# EAGLE design proto_base (EAGLE 9.6.2)
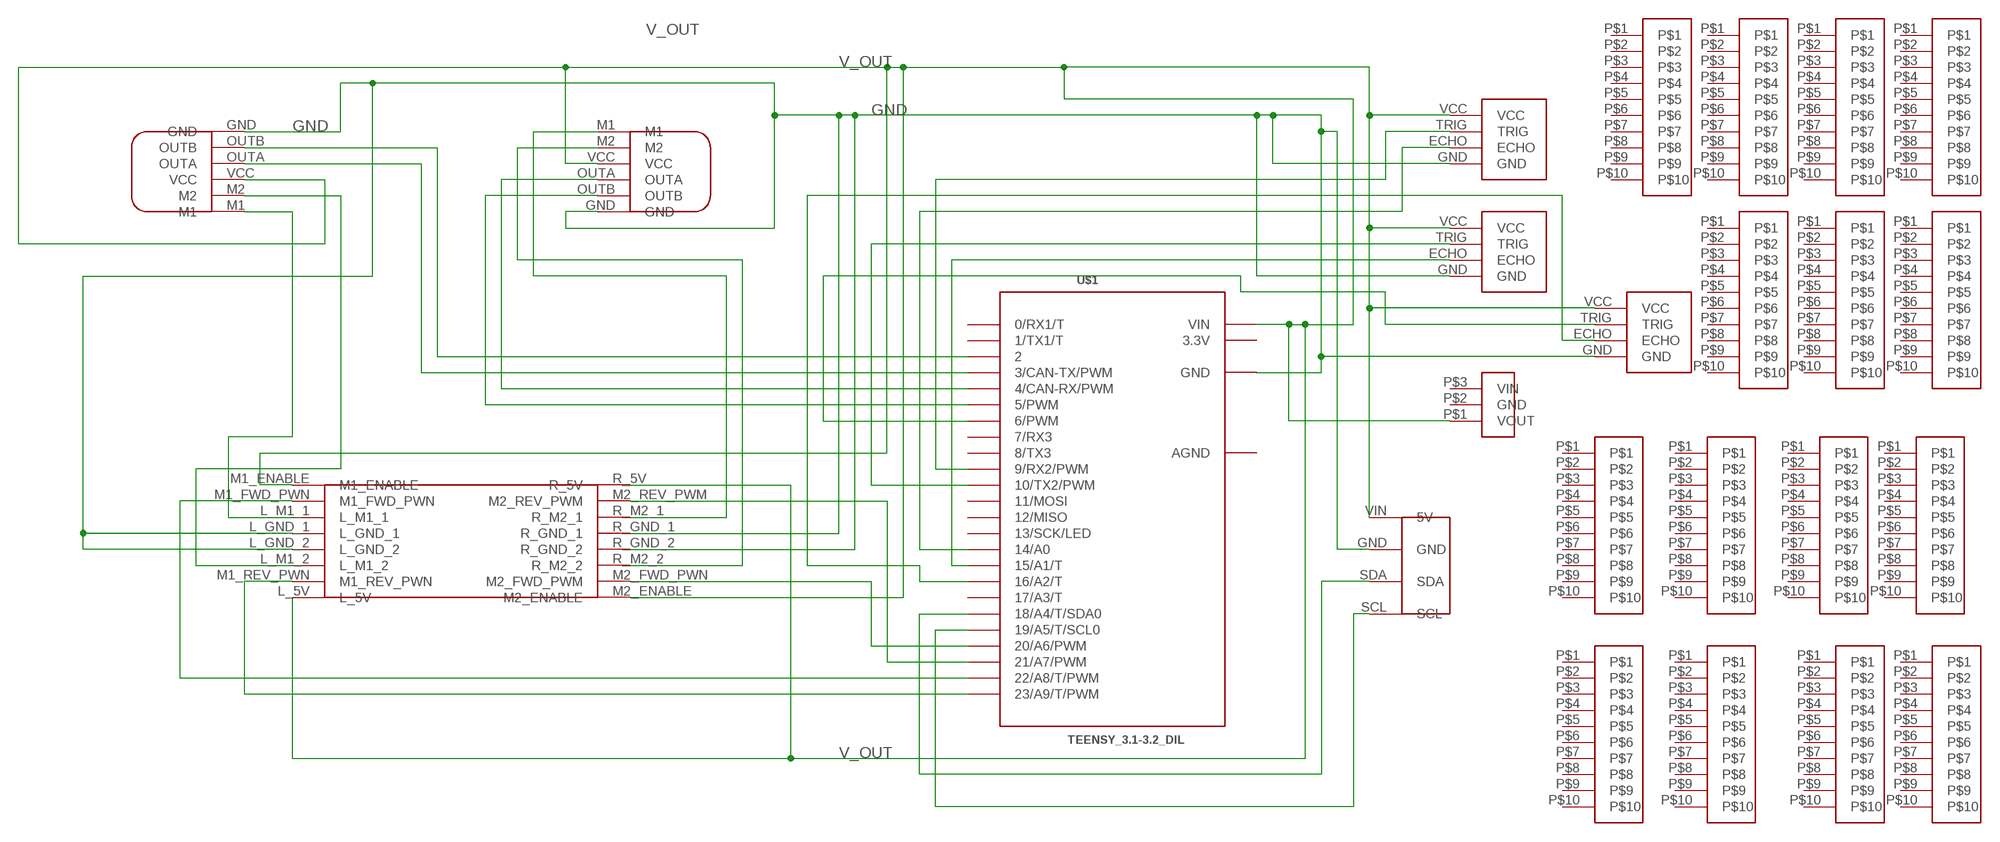
[diagram p0: schematic, sheet 1]

## Parts
IMU  IMU  [IMU]
LEFT_ENCODER  MOTOR_ENCODER  [MOTOR_ENCODER]
MOTOR_DRIVER  MOTOR_DRIVER  [MOTOR_DRIVER]
RIGHT_ENCODER  MOTOR_ENCODER  [MOTOR_ENCODER]
U$1  TEENSY_3.1-3.2_DIL  [TEENSY_3.0-3.2&LC_DIL]
U$2  VOLTAGE_REGULATOR  [VOLTAGE_REGULATOR]
U$3  SONAR_SENSOR  [SONAR_SENSOR]
U$4  SONAR_SENSOR  [SONAR_SENSOR]
U$5  SONAR_SENSOR  [SONAR_SENSOR]
U$6  TEST_ROW  [TEST_ROW]
U$7  TEST_ROW  [TEST_ROW]
U$8  TEST_ROW  [TEST_ROW]
U$9  TEST_ROW  [TEST_ROW]
U$10  TEST_ROW  [TEST_ROW]
U$11  TEST_ROW  [TEST_ROW]
U$12  TEST_ROW  [TEST_ROW]
U$13  TEST_ROW  [TEST_ROW]
U$14  TEST_ROW  [TEST_ROW]
U$15  TEST_ROW  [TEST_ROW]
U$16  TEST_ROW  [TEST_ROW]
U$17  TEST_ROW  [TEST_ROW]
U$18  TEST_ROW  [TEST_ROW]
U$19  TEST_ROW  [TEST_ROW]
U$20  TEST_ROW  [TEST_ROW]

## Nets
GND: IMU.GND LEFT_ENCODER.GND MOTOR_DRIVER.L_GND_1 MOTOR_DRIVER.L_GND_2 MOTOR_DRIVER.R_GND_1 MOTOR_DRIVER.R_GND_2 RIGHT_ENCODER.GND U$1.GND U$3.GND U$4.GND U$5.GND
N$1: LEFT_ENCODER.OUTB U$1.2
N$2: LEFT_ENCODER.OUTA U$1.3(3/CAN-TX/PWM)
N$3: RIGHT_ENCODER.OUTA U$1.4(4/CAN-RX/PWM)
N$4: RIGHT_ENCODER.OUTB U$1.5(5/PWM)
N$6: LEFT_ENCODER.M2 MOTOR_DRIVER.L_M1_2
N$7: LEFT_ENCODER.M1 MOTOR_DRIVER.L_M1_1
N$8: U$1.9(9/RX2/PWM) U$3.TRIG
N$9: U$1.14/A0 U$3.ECHO
N$10: IMU.SDA U$1.18/A4(18/A4/T/SDA0)
N$11: MOTOR_DRIVER.M1_REV_PWN U$1.23/A9(23/A9/T/PWM)
N$12: MOTOR_DRIVER.M1_FWD_PWN U$1.22/A8(22/A8/T/PWM)
N$13: MOTOR_DRIVER.M2_REV_PWM U$1.21/A7(21/A7/PWM)
N$14: MOTOR_DRIVER.M2_FWD_PWN(M2_FWD_PWM) U$1.20/A6(20/A6/PWM)
N$15: MOTOR_DRIVER.R_M2_1 RIGHT_ENCODER.M1
N$16: MOTOR_DRIVER.R_M2_2 RIGHT_ENCODER.M2
N$17: IMU.SCL U$1.19/A5(19/A5/T/SCL0)
N$18: U$1.10(10/TX2/PWM) U$4.TRIG
N$19: U$1.15/A1(15/A1/T) U$4.ECHO
N$20: U$1.6(6/PWM) U$5.TRIG
N$21: U$1.16/A2(16/A2/T) U$5.ECHO
V_OUT: IMU.VIN(5V) LEFT_ENCODER.VCC MOTOR_DRIVER.L_5V MOTOR_DRIVER.M1_ENABLE MOTOR_DRIVER.M2_ENABLE MOTOR_DRIVER.R_5V RIGHT_ENCODER.VCC U$1.VIN U$2.P$1(VOUT) U$3.VCC U$4.VCC U$5.VCC
Unconnected: U$1.0(0/RX1/T) U$1.1(1/TX1/T) U$1.7(7/RX3) U$1.8(8/TX3) U$1.11(11/MOSI) U$1.12(12/MISO) U$1.13(13/SCK/LED) U$1.17/A3(17/A3/T) U$2.P$2(GND) U$2.P$3(VIN) U$6.P$1 U$6.P$2 U$6.P$3 U$6.P$4 U$6.P$5 U$6.P$6 U$6.P$7 U$6.P$8 U$6.P$9 U$6.P$10 U$7.P$1 U$7.P$2 U$7.P$3 U$7.P$4 U$7.P$5 U$7.P$6 U$7.P$7 U$7.P$8 U$7.P$9 U$7.P$10 U$8.P$1 U$8.P$2 U$8.P$3 U$8.P$4 U$8.P$5 U$8.P$6 U$8.P$7 U$8.P$8 U$8.P$9 U$8.P$10 U$9.P$1 U$9.P$2 U$9.P$3 U$9.P$4 U$9.P$5 U$9.P$6 U$9.P$7 U$9.P$8 U$9.P$9 U$9.P$10 U$10.P$1 U$10.P$2 U$10.P$3 U$10.P$4 U$10.P$5 U$10.P$6 U$10.P$7 U$10.P$8 U$10.P$9 U$10.P$10 U$11.P$1 U$11.P$2 U$11.P$3 U$11.P$4 U$11.P$5 U$11.P$6 U$11.P$7 U$11.P$8 U$11.P$9 U$11.P$10 U$12.P$1 U$12.P$2 U$12.P$3 U$12.P$4 U$12.P$5 U$12.P$6 U$12.P$7 U$12.P$8 U$12.P$9 U$12.P$10 U$13.P$1 U$13.P$2 U$13.P$3 U$13.P$4 U$13.P$5 U$13.P$6 U$13.P$7 U$13.P$8 U$13.P$9 U$13.P$10 U$14.P$1 U$14.P$2 U$14.P$3 U$14.P$4 U$14.P$5 U$14.P$6 U$14.P$7 U$14.P$8 U$14.P$9 U$14.P$10 U$15.P$1 U$15.P$2 U$15.P$3 U$15.P$4 U$15.P$5 U$15.P$6 U$15.P$7 U$15.P$8 U$15.P$9 U$15.P$10 U$16.P$1 U$16.P$2 U$16.P$3 U$16.P$4 U$16.P$5 U$16.P$6 U$16.P$7 U$16.P$8 U$16.P$9 U$16.P$10 U$17.P$1 U$17.P$2 U$17.P$3 U$17.P$4 U$17.P$5 U$17.P$6 U$17.P$7 U$17.P$8 U$17.P$9 U$17.P$10 U$18.P$1 U$18.P$2 U$18.P$3 U$18.P$4 U$18.P$5 U$18.P$6 U$18.P$7 U$18.P$8 U$18.P$9 U$18.P$10 U$19.P$1 U$19.P$2 U$19.P$3 U$19.P$4 U$19.P$5 U$19.P$6 U$19.P$7 U$19.P$8 U$19.P$9 U$19.P$10 U$20.P$1 U$20.P$2 U$20.P$3 U$20.P$4 U$20.P$5 U$20.P$6 U$20.P$7 U$20.P$8 U$20.P$9 U$20.P$10

## Power pins joined to a net without a drawn wire
3.3V: U$1.3.3V
AGND: U$1.AGND

## Library data of the parts
IMU = IMU:IMU
LEFT_ENCODER RIGHT_ENCODER = MOTOR_ENCODER:MOTOR_ENCODER
MOTOR_DRIVER = motor_driver:MOTOR_DRIVER
U$1 = Teensy_3_and_LC_Series_Boards_v1.4:TEENSY_3.1-3.2_DIL: Teensy 3.1 or 3.2 in a DIL Layout.
U$2 = VOLTAGE_REGULATOR:VOLTAGE_REGULATOR
U$3-U$5 = SONAR_SENSOR:SONAR_SENSOR
U$6-U$20 = TEST_ROW:TEST_ROW

## Board
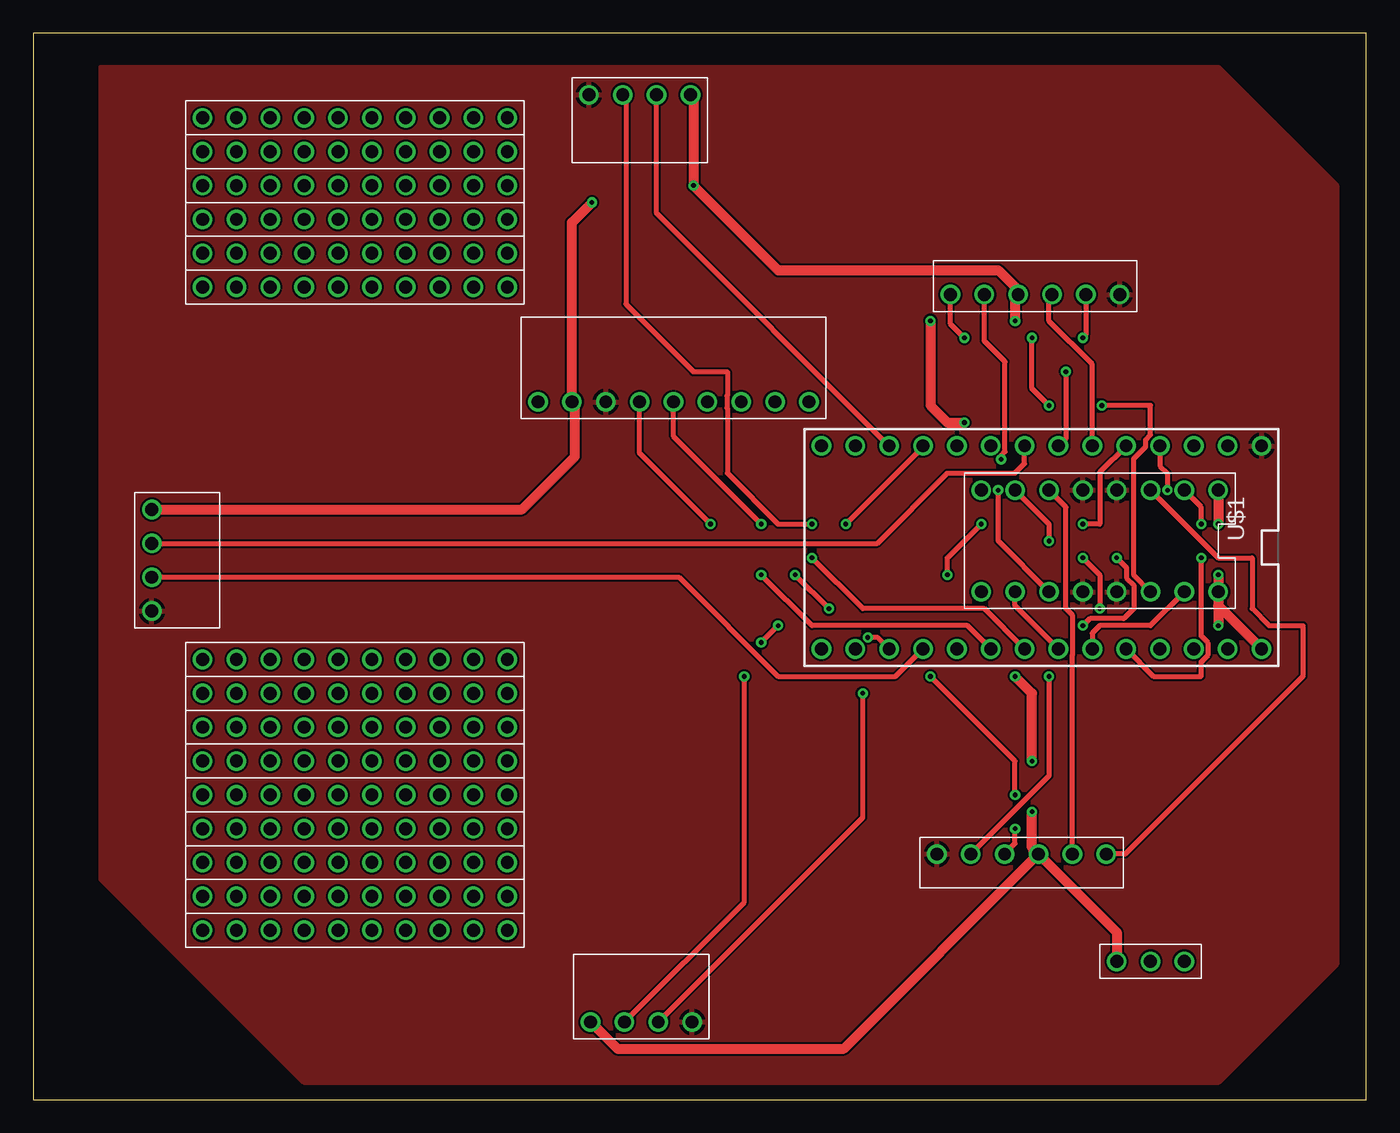
[diagram p1: board, top side]
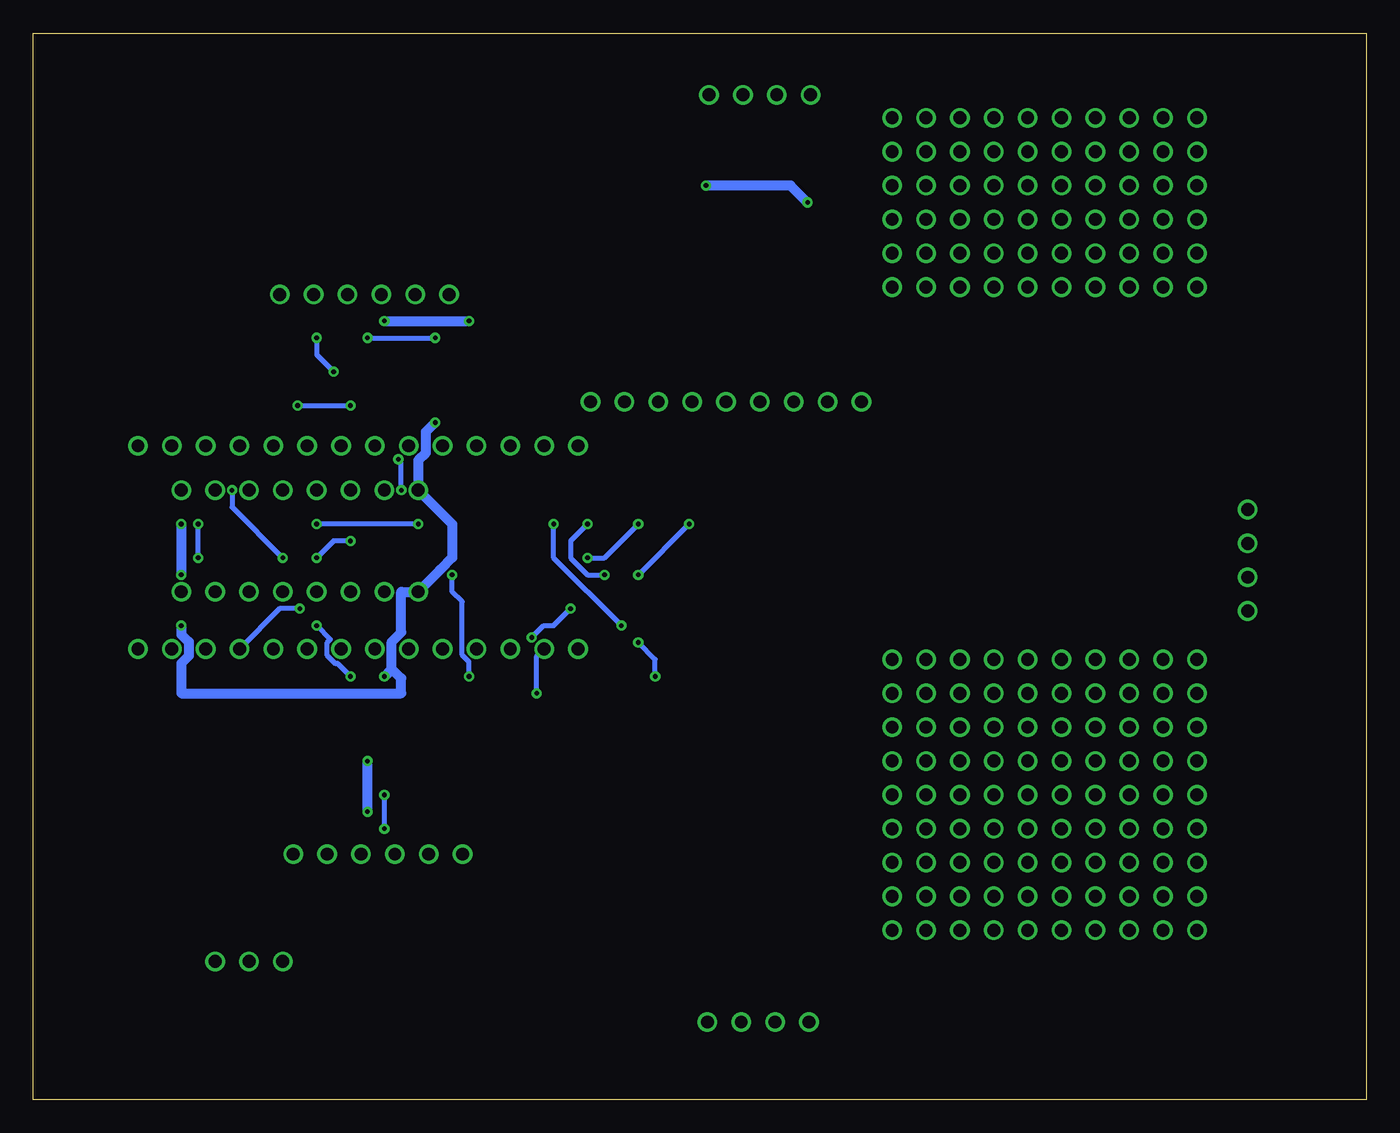
[diagram p2: board, bottom side, seen from below]

Size 100 x 80 mm. Coordinates in mm from the lower left corner, seen from the top.
Outline: 0,0 100,0 100,80 0,80 0,0
Copper layers (1*16): Top 0.035mm / dielectric 1.5mm / Bottom 0.035mm
Design rules "default": minimum track width 6mil, minimum drill 0.35mm, track to track 6mil, track to pad 6mil, pad to pad 6mil, via to via 6mil, smd to smd 6mil, copper to edge 40mil, drill to drill 6mil, minimum pad ring 10mil, minimum via ring 8mil, stop-mask expansion 4mil, vias tented up to drill 0mil, thermal gap 10mil

### Footprints (pad centres in the part's own frame; a part is rotated, then mirrored left to right if it is on the bottom)
IMU = drill 0.965: GND -1.27,0; NO_USE_1 -1.27,5.08; NO_USE_2 -1.27,-7.62; NO_USE_3 -1.27,-10.16; NO_USE_4 -1.27,-12.7; NO_USE_5 -1.27,-15.24; SCL -1.27,-5.08; SDA -1.27,-2.54; VIN -1.27,2.54
MOTOR_ENCODER = drill 0.965: GND -1.27,3.81; M1 -1.27,-8.89; M2 -1.27,-6.35; OUTA -1.27,-1.27; OUTB -1.27,1.27; VCC -1.27,-3.81
MOTOR_DRIVER = drill 0.965: L_5V -3.81,-11.43; L_GND_1 -3.81,-1.27; L_GND_2 -3.81,-3.81; L_M1_1 -3.81,1.27; L_M1_2 -3.81,-6.35; M1_ENABLE -3.81,6.35; M1_FWD_PWN -3.81,3.81; M1_REV_PWN -3.81,-8.89; M2_ENABLE 3.81,-11.43; M2_FWD_PWN 3.81,-8.89; M2_REV_PWM 3.81,3.81; R_5V 3.81,6.35; R_GND_1 3.81,-1.27; R_GND_2 3.81,-3.81; R_M2_1 3.81,1.27; R_M2_2 3.81,-6.35
TEENSY_3.0-3.2&LC_DIL = drill 0.965: 0 -7.62,13.97; 1 -7.62,11.43; 2 -7.62,8.89; 3 -7.62,6.35; 3.3V 7.62,11.43; 4 -7.62,3.81; 5 -7.62,1.27; 6 -7.62,-1.27; 7 -7.62,-3.81; 8 -7.62,-6.35; 9 -7.62,-8.89; 10 -7.62,-11.43; 11 -7.62,-13.97; 12 -7.62,-16.51; 13 7.62,-16.51; 14/A0 7.62,-13.97; 15/A1 7.62,-11.43; 16/A2 7.62,-8.89; 17/A3 7.62,-6.35; 18/A4 7.62,-3.81; 19/A5 7.62,-1.27; 20/A6 7.62,1.27; 21/A7 7.62,3.81; 22/A8 7.62,6.35; 23/A9 7.62,8.89; AGND 7.62,13.97; GND -7.62,16.51; VIN 7.62,16.51
VOLTAGE_REGULATOR = drill 0.965: P$1 -2.54,0; P$2 0,0; P$3 2.54,0
SONAR_SENSOR = drill 0.965: ECHO -1.27,-3.81; GND -1.27,-6.35; TRIG -1.27,-1.27; VCC -1.27,1.27
TEST_ROW = drill 0.965: P$1 0,5.08; P$2 0,2.54; P$3 0,0; P$4 0,-2.54; P$5 0,-5.08; P$6 0,-7.62; P$7 0,-10.16; P$8 0,-12.7; P$9 0,-15.24; P$10 0,-17.78

### Placement (x,y rotation side)
IMU  42.95,53.62 90 top
LEFT_ENCODER  71.6,19.68 90 top
MOTOR_DRIVER  82.55,41.91 270 top
RIGHT_ENCODER  77.7,59.13 270 top
U$1  75.64,41.43 270 top
U$2  83.82,10.36 0 top
U$3  43.08,7.09 90 top
U$4  48.03,74.12 270 top
U$5  10.16,43 0 top
U$6  17.78,27.94 90 top
U$7  17.78,25.4 90 top
U$8  17.78,22.86 90 top
U$9  17.78,20.32 90 top
U$10  17.78,17.78 90 top
U$11  17.78,15.24 90 top
U$12  17.78,63.5 90 top
U$13  17.78,60.96 90 top
U$14  17.78,66.04 90 top
U$15  17.78,68.58 90 top
U$16  17.78,71.12 90 top
U$17  17.78,30.48 90 top
U$18  17.78,73.66 90 top
U$19  17.78,33.02 90 top
U$20  17.78,12.7 90 top

### Tracks (layer width: path | path; a pad name or v marks a point on that pad's centre or on a via)
GND
  pour Top: 6.35,77.47 88.9,77.47 97.79,68.58 97.79,10.16 88.9,1.27 20.32,1.27 11.43,10.16 5.08,16.51 5.08,77.47
N$1  (via drill 0.35)
  Top 0.381: U$1.2 84.53,47.55 85.09,46.99 v85.09,45.72 | v81.28,40.64 82.02,39.9 82.02,39.15 82.55,38.62 82.55,36.83 81.81,36.09 79.27,36.09 v78.74,35.56 | v76.2,31.75 76.2,24.28 LEFT_ENCODER.OUTB
  Bottom 0.381: v85.09,45.72 85.09,44.45 v81.28,40.64 | v78.74,35.56 77.71,34.53 77.99,34.26 77.99,33.36 77.36,32.73 77.18,32.73 v76.2,31.75
N$2  (via drill 0.35)
  Top 0.381: LEFT_ENCODER.OUTA 73.66,19.2 v73.66,20.32 | v73.66,22.86 73.66,25.4 v67.31,31.75 | v68.58,39.37 68.58,40.64 v71.12,43.18 | U$1.3 80.01,47.07 80.01,43.18 v78.74,43.18
  Bottom 0.381: v73.66,20.32 v73.66,22.86 | v67.31,31.75 67.31,32.84 67.83,33.36 67.83,37.35 68.58,38.1 v68.58,39.37 | v71.12,43.18 v78.74,43.18
N$3
  Top 0.381: U$1.4 79.45,55.17 76.2,58.42 76.2,60.17 RIGHT_ENCODER.OUTA
N$4  (via drill 0.35)
  Top 0.381: RIGHT_ENCODER.OUTB 78.97,57.38 v78.74,57.15 | v77.47,54.61 77.47,49.61 U$1.5
  Bottom 0.381: v78.74,57.15 78.74,55.88 v77.47,54.61
N$6
  Top 0.381: LEFT_ENCODER.M2 77.95,33.32 77.99,33.36 77.99,36.31 77.47,36.83 77.47,44.45 MOTOR_DRIVER.L_M1_2
N$7
  Top 0.381: LEFT_ENCODER.M1 81.92,18.41 95.25,31.75 95.25,35.56 92.71,35.56 91.44,36.83 91.44,40.64 88.9,40.64 MOTOR_DRIVER.L_M1_1
N$8  (via drill 0.35)
  Top 0.381: U$3.TRIG 53.34,14.81 v53.34,31.75 | v54.61,34.29 v55.88,35.56 | v60.96,43.18 66.75,48.97 U$1.9
  Bottom 0.381: v53.34,31.75 53.34,33.02 v54.61,34.29 | v55.88,35.56 60.96,40.64 v60.96,43.18
N$9  (via drill 0.35)
  Top 0.381: U$3.ECHO 62.23,21.16 v62.23,30.48
  Bottom 0.381: v62.23,30.48 62.23,33.25 U$1.14/A0
N$10  (via drill 0.35)
  Top 0.381: U$1.18/A4 70.08,35.56 58.42,35.56 v54.61,39.37 | v50.8,43.18 45.49,48.49 IMU.SDA
  Bottom 0.381: v54.61,39.37 v50.8,43.18
N$11  (via drill 0.35)
  Top 0.381: MOTOR_DRIVER.M1_REV_PWN 76.2,43.18 v76.2,41.91 | v78.74,40.64 80.01,39.37 v80.01,36.83
  Bottom 0.381: v76.2,41.91 77.47,41.91 v78.74,40.64 | v80.01,36.83 81.51,36.83 U$1.23/A9
N$12  (via drill 0.35)
  Top 0.381: U$1.22/A8 84.05,31.75 87.63,31.75 87.63,32.84 88.15,33.36 88.15,34.26 87.63,34.77 v87.63,40.64 | v87.63,43.18 87.63,44.45 MOTOR_DRIVER.M1_FWD_PWN
  Bottom 0.381: v87.63,40.64 v87.63,43.18
N$13
  Top 0.381: MOTOR_DRIVER.M2_REV_PWM 83.82,35.56 80.01,35.56 79.45,35 U$1.21/A7
N$14
  Top 0.381: U$1.20/A6 73.66,37.06 MOTOR_DRIVER.M2_FWD_PWN
N$15  (via drill 0.35)
  Top 0.381: MOTOR_DRIVER.R_M2_1 82.55,39.37 82.55,48.08 83.45,48.98 83.45,49.49 83.82,49.86 83.82,52.07 v80.17,52.07 | v76.2,52.07 74.93,53.34 v74.93,57.15 | v69.85,57.15 68.81,58.19 RIGHT_ENCODER.M1
  Bottom 0.381: v80.17,52.07 v76.2,52.07 | v74.93,57.15 v69.85,57.15
N$16  (via drill 0.35)
  Top 0.381: MOTOR_DRIVER.R_M2_2 72.39,41.91 v72.39,45.72 | v72.61,48.04 72.61,48.3 72.91,48.6 72.91,55.36 71.35,56.92 RIGHT_ENCODER.M2
  Bottom 0.381: v72.39,45.72 72.39,48.08 72.48,48.17 v72.61,48.04
N$17  (via drill 0.35)
  Top 0.381: U$1.19/A5 71.35,36.83 62.23,36.83 v58.42,40.64 | v54.61,43.18 48.03,49.76 IMU.SCL
  Bottom 0.381: v58.42,40.64 57.15,40.64 v54.61,43.18
N$18
  Top 0.381: U$1.10 46.76,66.5 U$4.TRIG
N$19  (via drill 0.35)
  Top 0.381: U$4.ECHO 44.45,75.16 44.45,59.69 49.53,54.61 52.07,54.61 52.07,52.84 52.03,52.8 52.03,51.9 52.07,51.86 52.07,46.99 55.88,43.18 v58.42,43.18 | v57.15,39.37 v59.69,36.83 | U$1.15/A1 63.35,34.66 v62.6,34.66
  Bottom 0.381: v58.42,43.18 59.69,41.91 59.69,40.64 58.42,39.37 v57.15,39.37 | v59.69,36.83 60.96,35.56 61.71,35.56 v62.6,34.66
N$20
  Top 0.381: U$5.TRIG 63.32,41.73 68.58,46.99 73.66,46.99 74.37,47.7 U$1.6
N$21
  Top 0.381: U$5.ECHO 48.44,39.19 55.88,31.75 64.69,31.75 U$1.16/A2
V_OUT  (via drill 0.35)
  Top 0.761: 88.9,37.06 MOTOR_DRIVER.R_5V v88.9,39.37 | MOTOR_DRIVER.M1_ENABLE v88.9,43.18 | U$4.VCC 49.53,75.16 v49.53,68.58 55.88,62.23 72.39,62.23 73.89,60.73 RIGHT_ENCODER.VCC 73.66,60.17 v73.66,58.42 | v67.31,58.42 67.31,52.07 68.58,50.8 v69.85,50.8 | 88.9,37.06 U$1.VIN | 88.9,37.06 v88.9,35.56
  Top 0.762: v41.91,67.31 40.41,65.81 IMU.VIN 40.64,52.12 40.64,48.26 36.65,44.27 U$5.VCC | U$3.VCC 43.81,3.81 60.81,3.81 LEFT_ENCODER.VCC | LEFT_ENCODER.VCC 81.28,12.55 U$2.P$1 | LEFT_ENCODER.VCC 74.93,18.9 v74.93,21.59 | v74.93,25.4 74.93,30.48 v73.66,31.75
  Bottom 0.761: v88.9,43.18 v88.9,39.37 | v73.66,58.42 v67.31,58.42 | v69.85,50.8 70.56,50.09 70.56,48.52 71.12,47.96 MOTOR_DRIVER.L_5V 68.58,43.18 68.58,40.66 69.49,39.75 69.49,39.73 MOTOR_DRIVER.M2_ENABLE | v88.9,35.56 88.9,34.89 88.34,34.33 88.34,33.28 88.9,32.72 88.9,30.48 72.39,30.48 72.39,31.6 73.1,32.31
  Bottom 0.762: v41.91,67.31 43.18,68.58 v49.53,68.58 | v74.93,21.59 v74.93,25.4 | v73.66,31.75 73.1,32.31 73.1,34.33 72.39,35.05 72.39,38.1 MOTOR_DRIVER.M2_ENABLE